# EAGLE board Pinscape Pico Expansion Board - DIY Friendly Main - Socketed Pico (EAGLE 7.7.0)
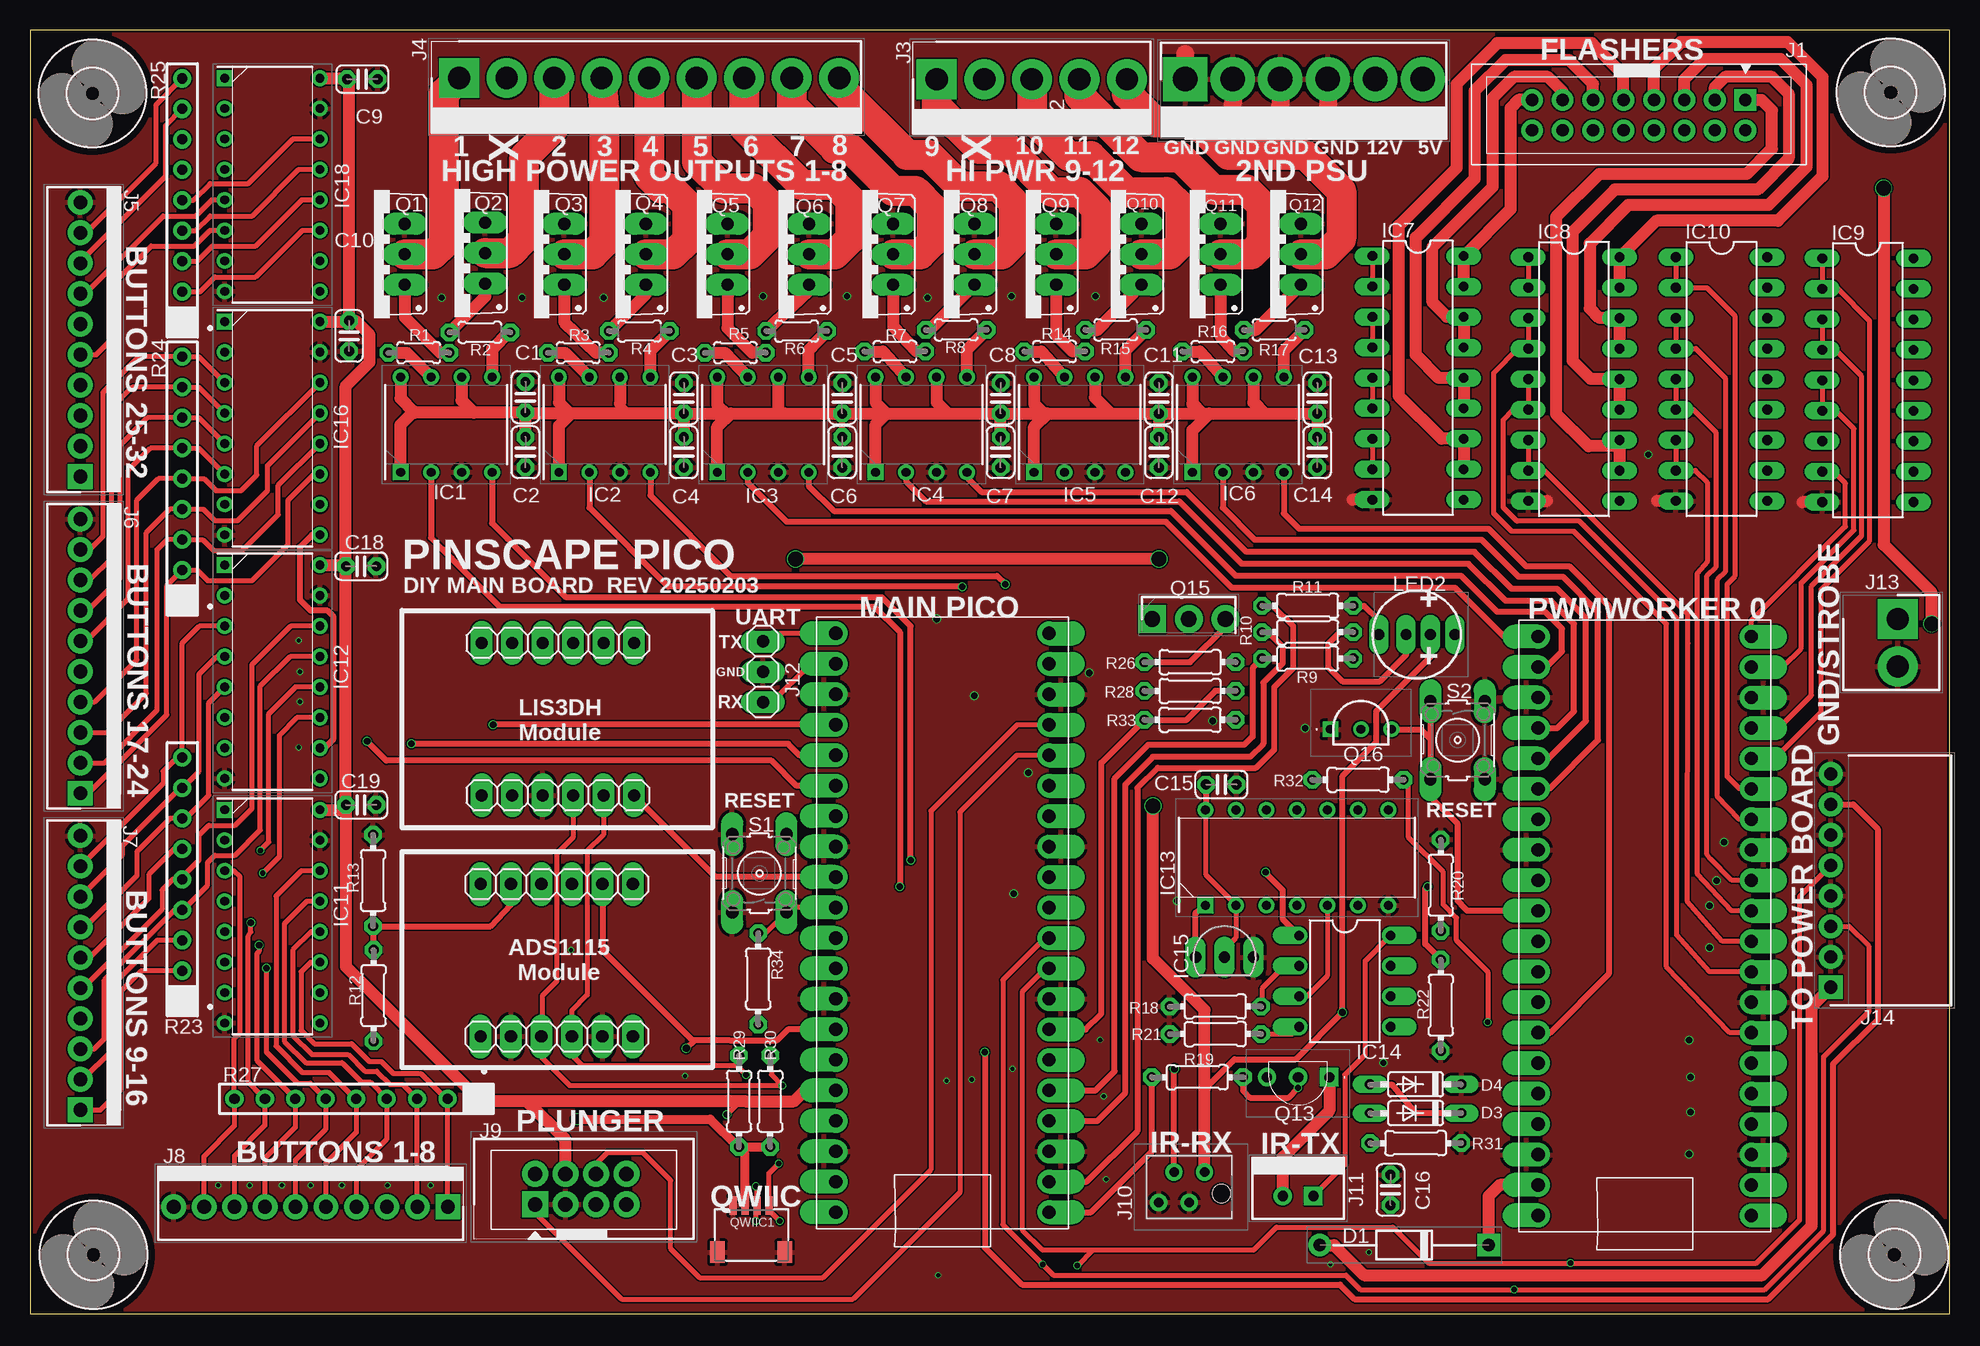
[diagram p11: board, top side]
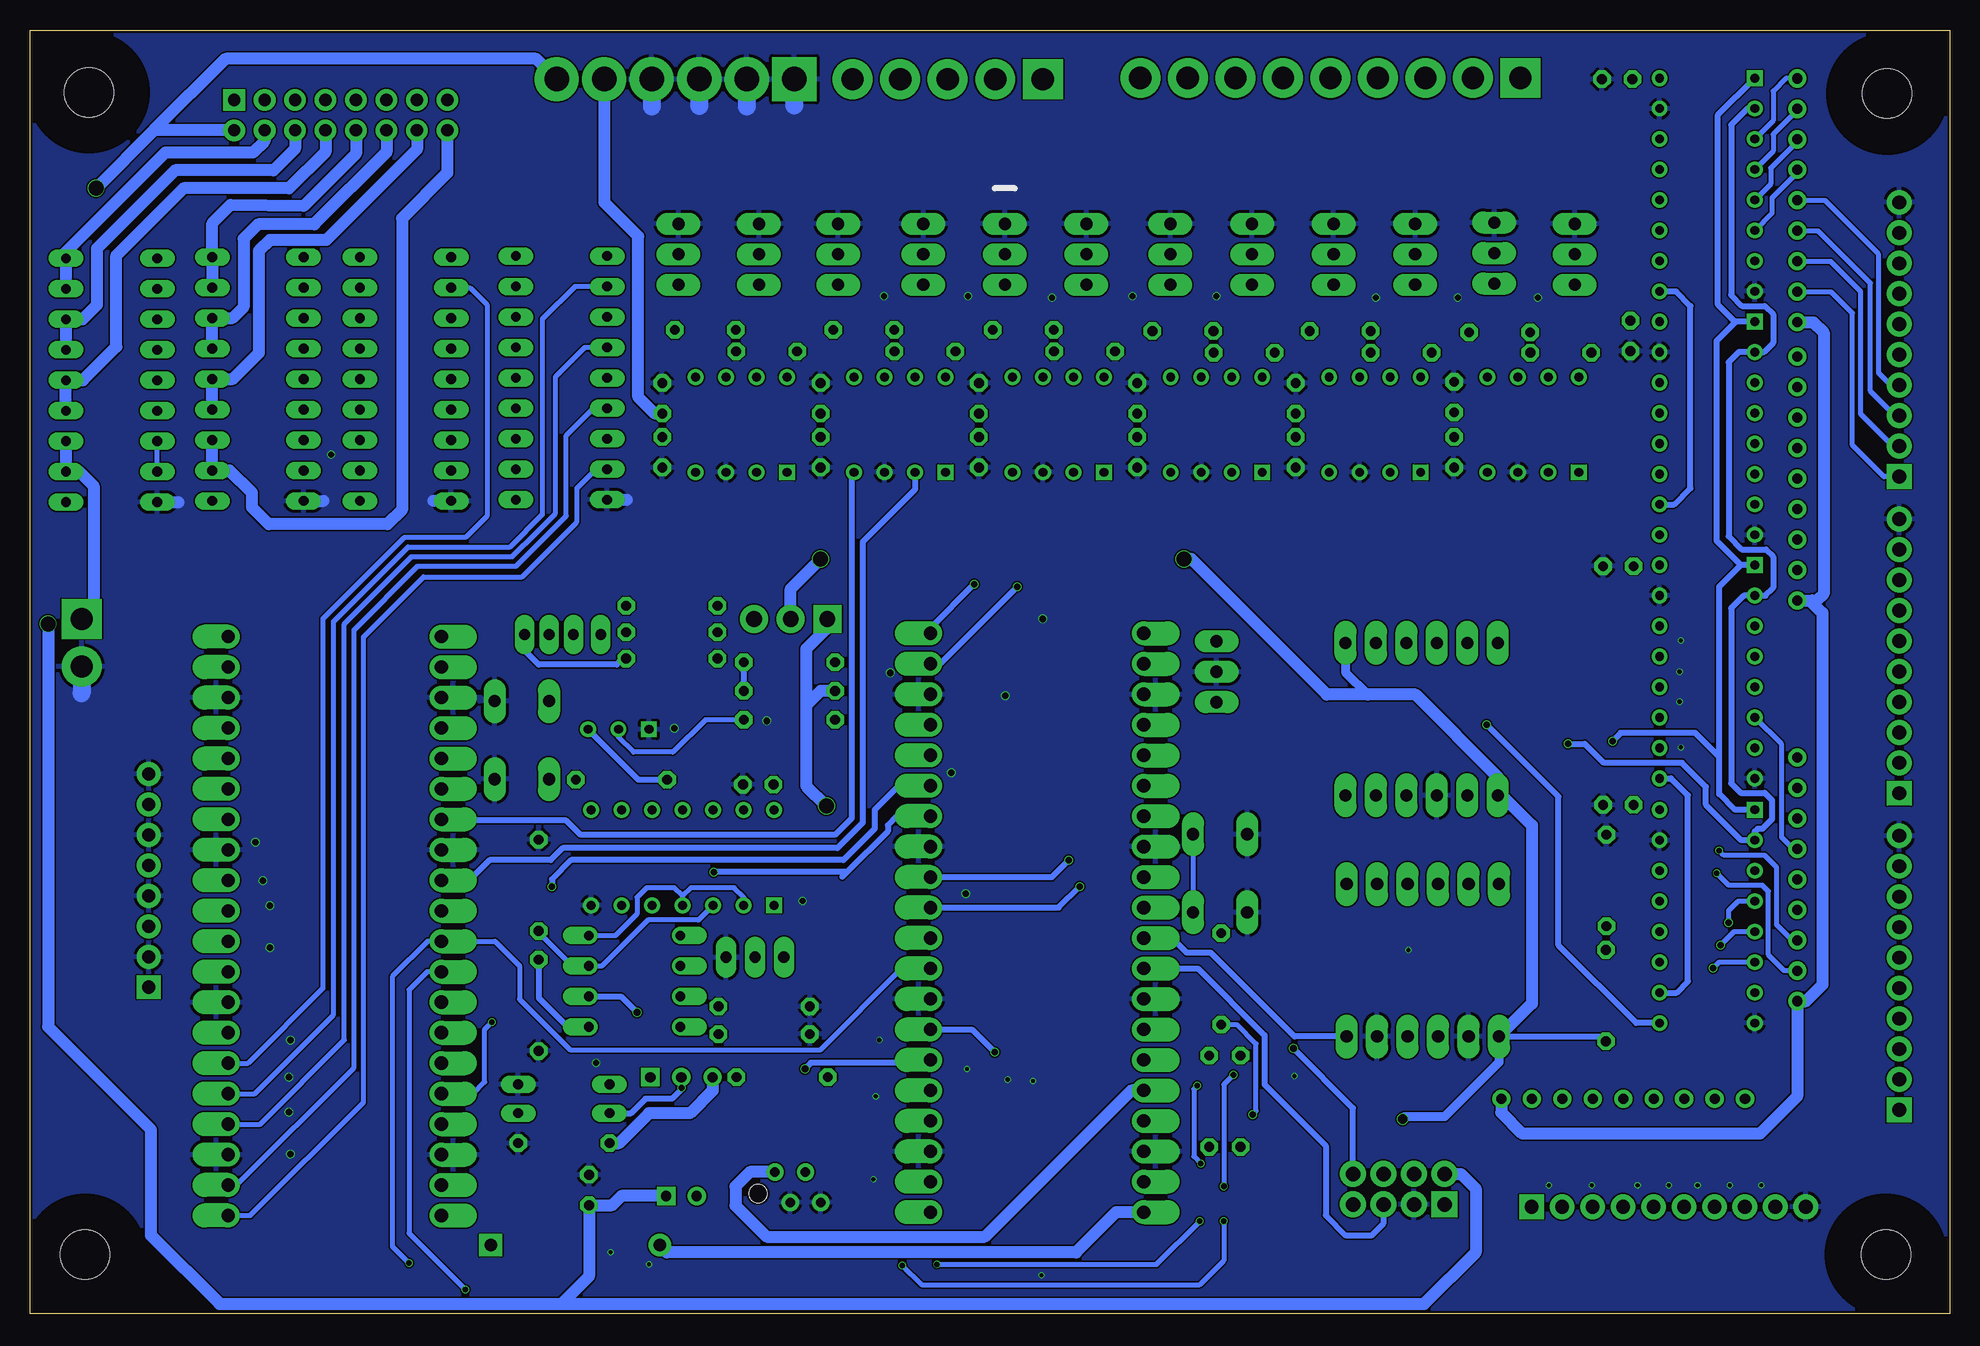
[diagram p12: board, bottom side, seen from below]

Size 160 x 107 mm. Coordinates in mm from the lower left corner, seen from the top.
Outline: 0,0 160,0 160,107 0,107 0,0
Copper layers (1*16): Top 0.035mm / dielectric 1.6mm / Bottom 0.035mm
Design rules "jlcpcb-2layers": minimum track width 5mil, minimum drill 0.3mm, track to track 5mil, track to pad 5mil, pad to pad 5mil, via to via 5mil, smd to smd 5mil, copper to edge 0.2mm, drill to drill 6mil, minimum pad ring 10mil, minimum via ring 3mil, stop-mask expansion 4mil, vias tented up to drill 0mil, thermal gap 10mil
Net classes: 1 highpower: width 0.305 mm, drill 0.483 mm

## Footprints (pad centres in the part's own frame; a part is rotated, then mirrored left to right if it is on the bottom)
C025-024X044 = drill 0.813 octagon: 1 -1.27,0; 2 1.27,0
DIOAD1408W86L464D236 = drill 1.05 pad 1.575 square: 1 0,0 | drill 1.05 pad 1.575: 2 14.1,0
DO35-7 = drill 0.813 long: A 3.81,0; C -3.81,0
DIP794W53P254L959H508Q8N = drill 0.73 pad 1.13 square: 1 -3.97,3.81 | drill 0.73 pad 1.13: 2 -3.97,1.27; 3 -3.97,-1.27; 4 -3.97,-3.81; 5 3.97,-3.81; 6 3.97,-1.27; 7 3.97,1.27; 8 3.97,3.81
DIL18 = drill 0.813 long: 1 -10.16,-3.81; 2 -7.62,-3.81; 3 -5.08,-3.81; 4 -2.54,-3.81; 5 0,-3.81; 6 2.54,-3.81; 7 5.08,-3.81; 8 7.62,-3.81; 9 10.16,-3.81; 10 10.16,3.81; 11 7.62,3.81; 12 5.08,3.81; 13 2.54,3.81; 14 0,3.81; 15 -2.54,3.81; 16 -5.08,3.81; 17 -7.62,3.81; 18 -10.16,3.81
DIP794W53P254L1930H508Q16N = drill 0.73 pad 1.13 square: 1 -3.97,8.89 | drill 0.73 pad 1.13: 2 -3.97,6.35; 3 -3.97,3.81; 4 -3.97,1.27; 5 -3.97,-1.27; 6 -3.97,-3.81; 7 -3.97,-6.35; 8 -3.97,-8.89; 9 3.97,-8.89; 10 3.97,-6.35; 11 3.97,-3.81; 12 3.97,-1.27; 13 3.97,1.27; 14 3.97,3.81; 15 3.97,6.35; 16 3.97,8.89
DIP794W53P254L1930H508Q14N = drill 0.73 pad 1.13 square: 1 -3.97,7.62 | drill 0.73 pad 1.13: 2 -3.97,5.08; 3 -3.97,2.54; 4 -3.97,0; 5 -3.97,-2.54; 6 -3.97,-5.08; 7 -3.97,-7.62; 8 3.97,-7.62; 9 3.97,-5.08; 10 3.97,-2.54; 11 3.97,0; 12 3.97,2.54; 13 3.97,5.08; 14 3.97,7.62
DIL08 = drill 0.813 offset: 1 -3.81,-3.81; 2 -1.27,-3.81; 3 1.27,-3.81; 4 3.81,-3.81; 5 3.81,3.81; 6 1.27,3.81; 7 -1.27,3.81; 8 -3.81,3.81
TO-92_(TO-226) = drill 0.94 pad 1.118 long: 1 1.143,0; 2 -1.27,0; 3 -3.683,0
3M-30316-6002HB = drill 1.01 pad 1.51 square: 1 -8.89,-1.27 | drill 1.01 pad 1.51: 2 -8.89,1.27; 3 -6.35,-1.27; 4 -6.35,1.27; 5 -3.81,-1.27; 6 -3.81,1.27; 7 -1.27,-1.27; 8 -1.27,1.27; 9 1.27,-1.27; 10 1.27,1.27; 11 3.81,-1.27; 12 3.81,1.27; 13 6.35,-1.27; 14 6.35,1.27; 15 8.89,-1.27; 16 8.89,1.27
SHDR6W183P0X396_1X6_2377X762X1 = drill 2.05 pad 3.075 square: 1 0,0 | drill 2.05 pad 3.075: 2 3.96,0; 3 7.92,0; 4 11.88,0; 5 15.84,0; 6 19.8,0
HDRV5W117P0X396_1X5_1981X762X1 = drill 1.85 pad 2.775 square: 1 7.92,0 | drill 1.85 pad 2.775: 2 3.958,0; 3 -0.004,0; 4 -3.966,0; 5 -7.928,0
SHDR9W117P0X396_1X9_3566X762X1 = drill 1.85 pad 2.775 square: 1 15.84,0 | drill 1.85 pad 2.775: 2 11.878,0; 3 7.916,0; 4 3.954,0; 5 -0.008,0; 6 -3.97,0; 7 -7.932,0; 8 -11.894,0; 9 -15.856,0
SHDR10W66P0X254_1X10_2540X572X = drill 1.15 pad 1.725 square: 1 11.43,0 | drill 1.15 pad 1.725: 2 8.89,0; 3 6.35,0; 4 3.81,0; 5 1.27,0; 6 -1.27,0; 7 -3.81,0; 8 -6.35,0; 9 -8.89,0; 10 -11.43,0
SHDR8W69P254_2X4_1780X878X955P = drill 1.2 pad 1.8 square: 1 0,0 | drill 1.2 pad 1.8: 2 0,2.54; 3 2.54,0; 4 2.54,2.54; 5 5.08,0; 6 5.08,2.54; 7 7.62,0; 8 7.62,2.54
2150794 = drill 0.8 pad 1.3: 1 0,0; 2 -1.27,-2.54; 3 -2.54,0; 4 -3.81,-2.54 | hole 1.5: 1.4,-1.8
HDRV2W66P0X254_1X2_762X572X100 = drill 0.85 pad 1.275 square: 1 1.27,0 | drill 0.85 pad 1.275: 2 -1.27,0
1X03 = drill 1.016 long: 1 -2.54,0; 2 0,0; 3 2.54,0
SHDR2W117P0X396_1X2_792X762X11 = drill 1.85 pad 2.775 square: 1 0,0 | drill 1.85 pad 2.775: 2 3.962,0
RHDRRA8W64P254_1X8_2083X851X24 = drill 1.1 pad 1.65 square: 1 0,0 | drill 1.1 pad 1.65: 2 -2.54,0; 3 -5.08,0; 4 -7.62,0; 5 -10.16,0; 6 -12.7,0; 7 -15.24,0; 8 -17.78,0
1X06 = drill 1.016 long: 1 -6.35,0; 2 -3.81,0; 3 -1.27,0; 4 1.27,0; 5 3.81,0; 6 6.35,0
5218559F = drill 0.91 pad 1.016 long: 1 0,1.27; 2 0,-0.762; 3 0,-2.794; 4 0,-5.08
RPI_PICO_TH_NO_DEBUG = drill 1.1 pad 1.6 offset: 3V3 8.89,13.97; 3V3_EN 8.89,16.51; ADC_VREF 8.89,11.43; AGND 8.89,6.35; GND@1 -8.89,19.05; GND@2 -8.89,6.35; GND@3 -8.89,-6.35; GND@4 -8.89,-19.05; GND@6 8.89,-19.05; GND@7 8.89,-6.35; GND@8 8.89,19.05; GP0 -8.89,24.13; GP1 -8.89,21.59; GP2 -8.89,16.51; GP3 -8.89,13.97; GP4 -8.89,11.43; GP5 -8.89,8.89; GP6 -8.89,3.81; GP7 -8.89,1.27; GP8 -8.89,-1.27; GP9 -8.89,-3.81; GP10 -8.89,-8.89; GP11 -8.89,-11.43; GP12 -8.89,-13.97; GP13 -8.89,-16.51; GP14 -8.89,-21.59; GP15 -8.89,-24.13; GP16 8.89,-24.13; GP17 8.89,-21.59; GP18 8.89,-16.51; GP19 8.89,-13.97; GP20 8.89,-11.43; GP21 8.89,-8.89; GP22 8.89,-3.81; GP26_A0 8.89,1.27; GP27_A1 8.89,3.81; GP28_A2 8.89,8.89; RUN 8.89,-1.27; VBUS 8.89,24.13; VSYS 8.89,21.59
TO220BV = drill 1.016 long: 1 -2.54,-2.54; 2 0,-2.54; 3 2.54,-2.54
BC33725 = drill 0.85 pad 1.381 square: 1 0,0 | drill 0.85 pad 1.381: 2 2.6,0; 3 5.2,0
TO229P300X760X1364-3P = drill 1.3 pad 1.95 square: 1 -0.762,0 | drill 1.3 pad 1.95: 2 2.29,0; 3 5.342,0
2N2222A = drill 0.72 pad 1.234 square: 1 0,0 | drill 0.72 pad 1.234: 2 2.54,0; 3 5.08,0
JST_SH4 = smd 0.6 x 1.55: 1 -1.5,2.514; 2 -0.5,2.514; 3 0.5,2.514; 4 1.5,2.514 | smd 1.2 x 1.8: MT1 -2.8,-1.386; MT2 2.8,-1.386
0204/5 = drill 0.813 pad 1.333 octagon: 1 -2.54,0; 2 2.54,0
0204/7 = drill 0.813 octagon: 1 -3.81,0; 2 3.81,0
4609X = drill 0.84 pad 1.34: 1 -10.16,0; 2 -7.62,0; 3 -5.08,0; 4 -2.54,0; 5 0,0; 6 2.54,0; 7 5.08,0; 8 7.62,0; 9 10.16,0
B3F-10XX = drill 1.016 long: 1 -3.251,2.261; 2 3.251,2.261; 3 -3.251,-2.261; 4 3.251,-2.261
4,1 = hole 4.1: 0,0

## Placement (x,y rotation side)
C1  100nF  [C025-024X044]  41.3,76.4 270 top
C2  4.7uF  [C025-024X044]  41.3,71.8 90 top
C3  100nF  [C025-024X044]  54.5,76.3 270 top
C4  4.7uF  [C025-024X044]  54.5,71.8 90 top
C5  100nF  [C025-024X044]  67.7,76.3 270 top
C6  4.7uF  [C025-024X044]  67.7,71.8 90 top
C7  100nF  [C025-024X044]  80.9,71.8 90 top
C8  4.7uF  [C025-024X044]  80.9,76.3 270 top
C9  100nF  [C025-024X044]  27.7,102.9 180 top
C10  100nF  [C025-024X044]  26.6,81.5 90 top
C11  100nF  [C025-024X044]  94.1,76.3 270 top
C12  4.7uF  [C025-024X044]  94.1,71.8 90 top
C13  100nF  [C025-024X044]  107.3,76.3 270 top
C14  4.7uF  [C025-024X044]  107.3,71.8 90 top
C15  100nF  [C025-024X044]  99.3,44.1 0 top
C16  4.7uF  [C025-024X044]  113.4,10.3 90 top
C18  100nF  [C025-024X044]  27.6,62.3 180 top
C19  100nF  [C025-024X044]  27.6,42.4 180 top
D1  SB140-T  [DIOAD1408W86L464D236]  121.6,5.7 180 top
D3  1N4148  [DO35-7]  115.5,16.7 180 top
D4  1N4148  [DO35-7]  115.5,19.1 180 top
IC1  UCC27524P  [DIP794W53P254L959H508Q8N]  34.7,74.1 90 top
IC2  UCC27524P  [DIP794W53P254L959H508Q8N]  47.9,74.1 90 top
IC3  UCC27524P  [DIP794W53P254L959H508Q8N]  61.1,74.1 90 top
IC4  UCC27524P  [DIP794W53P254L959H508Q8N]  74.3,74.1 90 top
IC5  UCC27524P  [DIP794W53P254L959H508Q8N]  87.5,74.1 90 top
IC6  UCC27524P  [DIP794W53P254L959H508Q8N]  100.7,74.1 90 top
IC7  ULN2803A  [DIL18]  115.7,78 270 top
IC8  ULN2803A  [DIL18]  128.7,77.9 270 top
IC9  ULN2803A  [DIL18]  153.2,77.8 270 top
IC10  ULN2803A  [DIL18]  141,77.9 270 top
IC11  SN74HC165N  [DIP794W53P254L1930H508Q16N]  20.2,33.1 0 top
IC12  SN74HC165N  [DIP794W53P254L1930H508Q16N]  20.2,53.5 0 top
IC13  SN74HC74NE4  [DIP794W53P254L1930H508Q14N]  105.6,38 90 top
IC14  PC827  [DIL08]  109.6,27.7 270 top
IC15  S-80833CLY  [TO-92_(TO-226)]  98.3,29.7 180 top
IC16  SN74HC165N  [DIP794W53P254L1930H508Q16N]  20.2,73.8 0 top
IC18  SN74HC165N  [DIP794W53P254L1930H508Q16N]  20.2,94.1 0 top
J1  30316-6002HB  [3M-30316-6002HB]  134.1,99.9 180 top
J2  640445-6  [SHDR6W183P0X396_1X6_2377X762X1]  96.3,102.9 0 top
J3  640445-5  [HDRV5W117P0X396_1X5_1981X762X1]  83.5,102.9 180 top
J4  640445-9  [SHDR9W117P0X396_1X9_3566X762X1]  51.6,103 180 top
J5  1-640456-0  [SHDR10W66P0X254_1X10_2540X572X]  4.2,81.2 270 top
J6  1-640456-0  [SHDR10W66P0X254_1X10_2540X572X]  4.2,54.8 270 top
J7  1-640456-0  [SHDR10W66P0X254_1X10_2540X572X]  4.2,28.4 270 top
J8  1-640456-0  [SHDR10W66P0X254_1X10_2540X572X]  23.4,8.9 0 top
J9  30308-6002HB  [SHDR8W69P254_2X4_1780X878X955P]  42.1,9.1 0 top
J10  215079-4  [2150794]  97.9,11.8 0 top
J11  640454-2  [HDRV2W66P0X254_1X2_762X572X100]  105.7,9.8 0 top
J12  [1X03]  61.1,53.5 270 top
J13  640445-2  [SHDR2W117P0X396_1X2_792X762X11]  155.7,57.9 270 top
J14  SSQ-108-02-T-S-RA  [RHDRRA8W64P254_1X8_2083X851X24]  150.1,27.2 270 top
JP1  [1X06]  44,55.9 0 top
JP2  [1X06]  44,43.2 0 top
JP3  [1X06]  43.9,35.8 0 top
JP4  [1X06]  43.9,23.1 0 top
LED2  521-8559F  [5218559F]  117.5,56.6 270 top
PICO1  [RPI_PICO_TH_NO_DEBUG]  76.05,32.57 180 top
PICO2  [RPI_PICO_TH_NO_DEBUG]  134.6,32.3 180 top
Q1  FDPF085N10A  [TO220BV]  28.7,88.3 90 top
Q2  FDPF085N10A  [TO220BV]  35.4,88.4 90 top
Q3  FDPF085N10A  [TO220BV]  42,88.3 90 top
Q4  FDPF085N10A  [TO220BV]  48.8,88.3 90 top
Q5  FDPF085N10A  [TO220BV]  55.6,88.3 90 top
Q6  FDPF085N10A  [TO220BV]  62.4,88.3 90 top
Q7  FDPF085N10A  [TO220BV]  69.4,88.3 90 top
Q8  FDPF085N10A  [TO220BV]  76.2,88.3 90 top
Q9  FDPF085N10A  [TO220BV]  83,88.3 90 top
Q10  FDPF085N10A  [TO220BV]  90.1,88.3 90 top
Q11  FDPF085N10A  [TO220BV]  96.7,88.3 90 top
Q12  FDPF085N10A  [TO220BV]  103.4,88.3 90 top
Q13  BC337-25  [BC33725]  108.3,19.7 180 top
Q15  2N5195G  [TO229P300X760X1364-3P]  94.3,57.9 0 top
Q16  2N2222A  [2N2222A]  108.4,48.7 0 top
QWIIC1  QWIIC  [JST_SH4]  60.1,6.5 0 top
R1  4R7  [0204/5]  32.4,80.1 0 top
R2  4R7  [0204/5]  37.5,81.8 180 top
R3  4R7  [0204/5]  45.7,80.1 0 top
R4  4R7  [0204/5]  50.8,81.9 180 top
R5  4R7  [0204/5]  58.8,80.1 0 top
R6  4R7  [0204/5]  63.9,81.9 180 top
R7  4R7  [0204/5]  72.1,80.2 0 top
R8  4R7  [0204/5]  77.2,82 180 top
R9  100R  [0204/7]  106.5,54.6 0 top
R10  10R  [0204/7]  106.5,56.8 0 top
R11  10R  [0204/7]  106.5,59 0 top
R12  10K  [0204/7]  28.64,26.5 270 top
R13  10K  [0204/7]  28.6,36.1 270 top
R14  4R7  [0204/5]  85.4,80.2 0 top
R15  4R7  [0204/5]  90.5,82 180 top
R16  4R7  [0204/5]  98.6,80.2 0 top
R17  4R7  [0204/5]  103.7,82 180 top
R18  240R  [0204/7]  98.8,25.6 0 top
R19  540R  [0204/7]  97.3,19.7 0 top
R20  10K  [0204/7]  117.6,35.7 90 top
R21  360R  [0204/7]  98.8,23.3 0 top
R22  10K  [0204/7]  117.6,25.7 90 top
R23  4609X-101-103F  [4609X]  12.7,36.2 90 top
R24  4609X-101-103F  [4609X]  12.7,69.6 90 top
R25  4609X-101-103F  [4609X]  12.7,92.8 90 top
R26  1K  [0204/7]  96.7,54.3 180 top
R27  4609X-101-103F  [4609X]  27.2,17.9 180 top
R28  22K  [0204/7]  96.7,51.9 180 top
R29  15K  [0204/7]  59.1,17.7 270 top
R30  15K  [0204/7]  61.7,17.7 270 top
R31  2R5  [0204/7]  115.5,14.2 180 top
R32  4.7K  [0204/7]  110.7,44.5 0 top
R33  2.2k  [0204/7]  96.7,49.5 0 top
R34  4.7K  [0204/7]  60.7,27.9 270 top
S1  [B3F-10XX]  60.8,36.7 90 top
S2  [B3F-10XX]  119,47.8 270 top
U$1  [4,1]  5.2,101.7 0 top
U$2  [4,1]  155.1,101.8 0 top
U$3  [4,1]  155.4,4.9 0 top
U$4  [4,1]  5.3,4.9 0 top

## Tracks (layer width: path | path; a pad name or v marks a point on that pad's centre or on a via)
3V3_PERIPHERAL  (via drill 0.8, 1.25)
  Top 0.5: R29.2 59.05,13.85
  Top 0.75: v45.6,16.2 56.7,16.2 59.05,13.85 59.6,13.3 QWIIC1.2 | R29.2 R30.2
  Top 1: v94.1,62.9 v63.8,62.9
  Bottom 0.5: JP4.1 29.05,23.1 R12.2
  Bottom 0.75: JP4.1 37.55,20.95 42.1,16.4 45.4,16.4 v45.6,16.2 | JP1.6 50.35,53.45 48.5,51.6
  Bottom 1: JP4.1 34.8,25.85 34.8,40.7 37.3,43.2 JP2.1 37.65,44.75 44.5,51.6 48.5,51.6 51.9,51.6 63.2,62.9 v63.8,62.9 | Q15.2 96.59,60.41 v94.1,62.9
3V3_PICO  (via drill 0.55, 0.6, 1.25)
  Top 0.4: 59.6,17.7 59.2,17.7 v58.1,16.6
  Top 0.5: 97.9,18.7 100.4,21.2 105.5,21.2 v109.4,25.1 109.4,44.8 112.2,47.6 112.2,50.2 116.74,54.74 LED2.2
  Top 1: 41.4,17.7 59.6,17.7 63.7,17.7 64.6,18.6 PICO1.3V3 | 41.4,17.7 37.56,17.7 R27.1 26.33,28.93 C19.2 | IC18.16 26.48,102.99 C9.2 26.6,102.73 C10.2 | IC16.16 26.52,82.69 C10.2 | IC12.16 26.18,62.39 C18.2 | IC11.16 26.18,41.99 C19.2 | C10.2 27.13,82.77 28.3,81.6 28.3,79.3 26.33,77.33 C18.2 | C19.2 C18.2 | J10.1 97.9,18.7 97.9,25.3 93.6,29.6 v93.6,42.3 | J9.4 44.64,14.46 41.4,17.7
  Bottom 0.4: R34.2 59.4,24.09 57.8,22.49 57.8,16.9 v58.1,16.6
  Bottom 0.5: IC14.6 110.73,26.43 v109.4,25.1
  Bottom 1: R27.1 37.36,16.76 35.6,15 15.8,15 12.7,18.1 R23.1 11.96,26.04 10.6,27.4 10.6,58.4 11.47,59.27 11.47,59.44 | R25.1 11.34,82.64 10.5,81.8 10.5,60 11.06,59.44 11.47,59.44 | R24.1 11.47,59.44 | Q15.1 93.6,57.84 93.6,57.1 95.3,55.4 95.3,50.7 | 95.3,50.7 95.3,44 v93.6,42.3 | R28.2 94.1,51.9 95.3,50.7 | J10.1 100,11.8 101.2,10.6 101.2,9 98.6,6.4 80.4,6.4 68.2,18.6 PICO1.3V3
5V  (via drill 1.25)
  Top 0.4: IC13.14 97.98,36.62 100.52,34.08 IC13.2 100.52,31.32 99.57,30.37 IC15.2 | IC14.8 111.3,29.4 111.3,21.6 109.6,19.9 109.6,12.43 J11.1
  Top 0.5: C15.1 98.03,42.02 IC13.14
  Top 1: v154.5,93.8 154.5,64.1 158.5,60.1 v158.5,57.5
  Bottom 0.4: 105.6,34.8 106.3,35.5 108.6,35.5 109.4,34.7 109.4,33.3 111.19,31.51 IC14.8 | IC13.4 105.6,34.8 | IC13.2 100.52,34.72 101.3,35.5 104.9,35.5 105.6,34.8
  Bottom 1: J1.2 149.67,98.63 | v158.5,57.5 158.5,23.9 149.9,15.3 149.9,6.5 144.2,0.8 115.7,0.8 | J9.2 40.74,11.64 39.5,10.4 39.5,5.1 43.8,0.8 115.7,0.8 | 149.67,98.63 v154.5,93.8 | J11.1 110.7,9.8 111.47,9.03 C16.1 113.4,3.1 115.7,0.8 | 149.67,98.63 143.7,104.6 117.8,104.6 J2.6
12V
  Top 0.406: 41.27,75.1 C1.2 | 41.27,73.1 C2.2
  Top 0.5: 32.09,75.1 32,75.19 | 45.1,75.03 45,75.03 | 41.4,75.03 C1.2 | 49.17,75.86 50,75.03 | 58,75.03 58.4,75.03 | C6.2 C5.2 | 62.37,75.56 62.9,75.03
  Top 1: IC1.8 30.89,76.3 32,75.19 30.89,74.09 IC1.1 | 37,75.1 41.27,75.1 41.27,73.1 | 37,75.1 32.09,75.1 | C3.2 50,75.03 45.1,75.03 44.09,74.02 IC2.1 | 41.4,75.03 45,75.03 44.09,75.94 IC2.8 | IC1.6 35.97,76.13 37,75.1 | IC2.6 49.17,75.86 | C4.2 C3.2 | C3.2 58,75.03 57.29,75.74 IC3.8 | 71.4,75.03 C5.2 62.9,75.03 58.4,75.03 57.29,73.92 IC3.1 | 71.4,75.03 76.5,75.03 | 76.5,75.03 C8.2 | C7.2 C8.2 | IC4.6 75.57,75.96 76.5,75.03 | IC4.8 70.49,75.94 71.4,75.03 | IC3.6 62.37,75.56 | IC4.1 70.49,74.12 71.4,75.03 | C8.2 84.5,75.03 | 84.5,75.03 84.8,75.03 | 84.8,75.03 90.1,75.03 | 90.1,75.03 C11.2 | C11.2 C12.2 | IC5.6 88.77,76.36 90.1,75.03 | IC5.8 83.69,75.84 84.5,75.03 | IC5.1 83.69,73.92 84.8,75.03 | C11.2 97.7,75.03 | 97.7,75.03 98.3,75.03 | 98.3,75.03 102.9,75.03 | 102.9,75.03 C13.2 C14.2 | IC6.8 96.89,75.84 97.7,75.03 | IC6.6 101.97,75.96 102.9,75.03 | IC6.1 96.89,73.62 98.3,75.03
  Bottom 1: C13.2 107.93,75.03 109.3,76.4 109.3,89.8 112.14,92.64 J2.5
$N377  (via drill 0.5)
  Top 0.5: R19.2 101.11,18.59 101.7,18 104.9,18 v105.7,18.8 Q13.2
  Bottom 0.5: v105.7,18.8 105.7,18.7 106.5,17.9 108.7,17.9 109.9,16.7 D3.A
/PERIPHERAL_POWER_ENABLE  (via drill 0.55)
  Top 0.5: R28.1 98.8,51.9 96.4,49.5 R33.1 89.3,45.91 89.3,25 87.98,23.68 PICO1.GP5 | v79.6,21.8 79.6,5.5 82.7,2.4 109.2,2.4 110.4,1.2 144.9,1.2 150.3,6.6 150.3,20.8 154,24.5 154,40.4 151.96,42.44 J14.7
  Bottom 0.5: R26.1 R28.1 | PICO1.GP5 81.48,23.68 v79.6,21.8
ACCEL_INTR
  Top 0.5: JP2.6 57.15,36.4 67.14,36.4 PICO1.GP22
ADC_INTR
  Bottom 0.5: JP4.6 54.6,23.1 61.6,30.1 63.6,30.1 64.8,31.3 PICO1.GP26_A0
BUTTON1
  Top 0.4: J8.1 R27.2 34.7,17.9 32.6,20 30.3,20 29.3,21 28.3,21 26.8,22.5 23.7,22.5 22.6,23.6 22.6,28.5 23.39,29.29 IC11.11
BUTTON2
  Top 0.4: J8.2 R27.3 31.08,19.1 30,19.1 28.9,20.2 27.9,20.2 26.5,21.6 23.5,21.6 21.9,23.2 21.9,30.3 23.43,31.83 IC11.12
BUTTON3
  Top 0.4: J8.4 27.21,12.01 29.74,14.54 R27.4 28.34,19.3 27.6,19.3 26,20.9 23,20.9 21.2,22.7 21.2,32.5 23.07,34.37 IC11.13
BUTTON4
  Top 0.4: J8.5 24.67,12.57 27.2,15.1 R27.5 27.1,17.9 24.9,20.1 24.1,20.1 23.8,20.1 22.7,20.1 20.5,22.3 20.5,34.8 22.61,36.91 IC11.14
BUTTON5  (via drill 0.55)
  Top 0.4: J8.6 22.13,12.83 24.66,15.36 R27.6 23.36,19.2 22.3,19.2 19.7,21.8 v19.7,28.8
  Bottom 0.4: IC11.6 19.21,29.29 v19.7,28.8
BUTTON6  (via drill 0.55)
  Top 0.4: J8.7 19.59,12.99 22.12,15.52 R27.7 18.9,21.12 18.9,30 19.1,30.2 v19.1,30.7
  Bottom 0.4: IC11.5 17.97,31.83 v19.1,30.7
BUTTON7  (via drill 0.55)
  Top 0.4: J8.8 17.05,13.15 19.58,15.68 R27.8 18.7,18.78 18.7,18.8 18.2,19.3 18.2,31.5 18.4,31.8 v18.4,32.6
  Bottom 0.4: v18.4,32.6 18.4,33.6 17.63,34.37 IC11.4
BUTTON8
  Top 0.4: J8.9 14.51,13.11 17.04,15.64 R27.9 17.04,22.94 17.5,23.4 17.5,36.4 16.99,36.91 IC11.3
BUTTON9  (via drill 0.45)
  Top 0.4: J7.1 5.87,16.97 7.6,18.7 7.6,26.9 9.28,28.58 R23.2 | v19.4,36.7 20.8,38.1 20.8,48.2 22.29,49.69 IC12.11
  Bottom 0.4: R23.2 13.78,28.58 15.1,29.9 15.1,35.2 15.6,35.7 18.4,35.7 v19.4,36.7
BUTTON10  (via drill 0.45)
  Top 0.4: J7.2 4.41,19.51 6.9,22 6.9,27.4 10.62,31.12 R23.3 | v19.2,38.6 19.9,39.3 19.9,50 22.13,52.23 IC12.12
  Bottom 0.4: R23.3 13.12,31.12 14.4,32.4 14.4,37.2 15.4,38.2 18.8,38.2 v19.2,38.6
BUTTON11
  Top 0.4: J7.3 5.35,22.05 6.2,22.9 6.2,27.8 12.06,33.66 R23.4 12.76,33.66 14.8,35.7 14.8,37.6 15.4,38.2 17.1,38.2 19.2,40.3 19.2,52.3 21.67,54.77 IC12.13
BUTTON12
  Top 0.4: J7.5 4.43,27.13 11,33.7 11,35.3 11.9,36.2 R23.5 12.7,36.4 14.1,37.8 14.1,39.9 14.9,40.7 17.1,40.7 18.5,42.1 18.5,54.1 21.71,57.31 IC12.14
BUTTON13
  Top 0.4: J7.6 4.97,29.67 9.9,34.6 9.9,36.6 12.04,38.74 R23.6
  Bottom 0.4: R23.6 13.04,38.74 14,39.7 14,47.46 IC12.6
BUTTON14
  Top 0.4: J7.7 4.61,32.21 8.9,36.5 8.9,38.5 11.68,41.28 R23.7 12.98,41.28 14.9,43.2 14.9,50.9 IC12.5
BUTTON15
  Top 0.4: 4.2,34.9 J7.8 7.7,38.25 7.7,39 12.52,43.82 R23.8 12.72,43.82 14.1,45.2 14.1,53.3 15.57,54.77 IC12.4
BUTTON16
  Top 0.4: J7.9 11.1,44.19 11.1,45.2 12.26,46.36 R23.9 12.7,55.9 14.11,57.31 IC12.3
BUTTON17
  Top 0.4: IC16.11 23.69,69.99 21.5,67.8 21.5,64.1 18.5,61.1 14.8,61.1 13.92,61.98 R24.2 11.4,60.68 11.4,49.9 4.87,43.37 J6.1
BUTTON18
  Top 0.4: J6.2 6.21,45.91 10.6,50.3 10.6,63.7 11.42,64.52 R24.3 14.38,64.52 15.3,63.6 17.7,63.6 20.7,66.6 20.7,69.06 IC16.12
BUTTON19
  Top 0.4: J6.3 6.45,48.45 9.7,51.7 9.7,65.1 11.66,67.06 R24.4 14.44,67.06 15.4,66.1 17.3,66.1 19.8,68.6 19.8,70.7 IC16.13
BUTTON20
  Top 0.4: J6.4 5.39,50.99 8.9,54.5 8.9,67.8 10.7,69.6 R24.5 14.5,69.6 15.5,68.6 17.6,68.6 18.9,69.9 18.9,72.34 IC16.14
BUTTON21
  Top 0.4: J6.6 4.67,56.07 8.2,59.6 8.2,70.3 10.04,72.14 R24.6 14.08,72.14 IC16.6
BUTTON22
  Top 0.4: J6.7 4.81,58.61 7.5,61.3 7.5,72.4 9.78,74.68 R24.7 14.08,74.68 IC16.5
BUTTON23
  Top 0.4: J6.8 4.95,61.15 6.8,63 6.8,75.5 8.52,77.22 R24.8 14.08,77.22 IC16.4
BUTTON24
  Top 0.4: J6.9 4.99,63.69 6.1,64.8 6.1,76.8 9.06,79.76 R24.9 14.08,79.76 IC16.3
BUTTON25
  Top 0.4: R25.2 14.18,85.18 15.4,86.4 18.8,86.4 22.69,90.29 IC18.11
  Bottom 0.4: J5.1 5.47,69.77 8.1,72.4 8.1,83.4 9.4,84.7 9.7,85 9.88,85.18 R25.2
BUTTON26
  Top 0.4: R25.3 13.92,87.72 15.2,89 18.8,89 22.63,92.83 IC18.12
  Bottom 0.4: J5.2 4.71,72.31 7.4,75 7.4,85.2 9.92,87.72 R25.3
BUTTON27
  Top 0.4: R25.4 13.76,90.26 15,91.5 18.5,91.5 22.37,95.37 IC18.13
  Bottom 0.4: J5.3 4.55,74.85 6.6,76.9 6.6,85.9 10.96,90.26 R25.4
BUTTON28
  Top 0.4: R25.5 13.6,92.8 15,94.2 18.2,94.2 21.91,97.91 IC18.14
  Bottom 0.4: J5.4 4.89,77.39 5.9,78.4 5.9,88.3 10.4,92.8 R25.5
BUTTON29
  Top 0.4: J5.5 5.53,79.93 6.7,81.1 6.7,85.6 10.1,89 13.7,89 14.99,90.29 IC18.6
  Bottom 0.4: R25.6 12.7,95.1 14.8,93 14.8,91.72 IC18.6
BUTTON30
  Top 0.4: J5.7 4.61,85.01 11.1,91.5 13.8,91.5 15.13,92.83 IC18.5
  Bottom 0.4: R25.7 12.7,97.7 14.9,95.5 14.9,94.16 IC18.5
BUTTON31
  Top 0.4: J5.8 4.2,87.7 11.3,94.8 11.3,99.02 R25.8
  Bottom 0.4: R25.8 12.7,100.3 14.7,98.3 14.7,96.9 IC18.4
BUTTON32
  Top 0.4: J5.9 4.69,90.09 10.5,95.9 10.5,100.76 R25.9
  Bottom 0.4: R25.9 13.64,102.96 14.7,101.9 14.7,99.44 IC18.3
BUTTON_CLK  (via drill 0.55)
  Top 0.5: v31.8,47.5 63.2,47.5 64.16,46.54 PICO1.GP19
  Bottom 0.5: IC18.2 16.85,100.45 18.2,99.1 18.2,84.9 17.3,84 15.4,84 14.7,83.3 14.7,80.9 15.45,80.15 IC16.2 17.55,80.15 18.4,79.3 18.4,64.8 17.3,63.7 15.3,63.7 14.7,63.1 14.7,60.5 15.35,59.85 IC12.2 17.15,59.85 18.2,58.8 18.2,44.2 17.4,43.4 15.4,43.4 14.8,42.8 14.8,41.2 15.6,40.4 16,40.4 16.23,40.17 IC11.2 17.35,39.45 20.3,42.4 20.3,43.9 22.3,45.9 28.8,45.9 30.4,47.5 v31.8,47.5
BUTTON_DATA  (via drill 0.55)
  Top 0.5: v38.6,49.1 67.14,49.1 PICO1.GP18
  Bottom 0.5: IC11.9 26.11,24.21 32.6,30.7 32.6,43.1 v38.6,49.1
BUTTON_SHLD  (via drill 0.55)
  Top 0.5: v28.1,47.7 29.7,46.1 61.8,46.1 63.9,44 PICO1.GP20
  Bottom 0.5: IC11.1 17.89,41.99 19.2,43.3 19.2,46.4 | 19.2,46.4 19.2,60.6 17.5,62.3 | 17.5,62.3 17.41,62.39 IC12.1 | 17.5,62.3 17.5,62.5 19.4,64.4 19.4,81.1 17.9,82.6 | 17.9,82.6 17.81,82.69 IC16.1 | 17.9,82.6 17.9,82.7 19.3,84.1 19.3,99.92 IC18.1 | 19.2,46.4 21.2,48.4 27.4,48.4 v28.1,47.7
FLASHCTL1
  Top 0.4: IC7.1 IC7.2
  Bottom 0.4: IC7.2 114.58,85.62 117.3,82.9 117.3,66.6 120,63.9 128.5,63.9 134.7,57.7 134.7,24.9 141.27,18.33 PICO2.GP3
FLASHCTL2
  Top 0.4: IC7.3 IC7.4
  Bottom 0.4: PICO2.GP2 140.81,15.79 133.8,22.8 133.8,57.5 128.2,63.1 119.8,63.1 117.7,65.2 117,65.9 116.2,66.7 116.2,78.1 113.76,80.54 IC7.4
FLASHCTL3
  Top 0.4: IC7.5 IC7.6
  Bottom 0.4: PICO2.GP1 142.79,10.71 133,20.5 133,57 127.7,62.3 119.5,62.3 117.3,64.5 117.05,64.75 115.3,66.5 115.3,73.2 113.04,75.46 IC7.6
FLASHCTL4
  Top 0.4: IC7.7 IC7.8
  Bottom 0.4: PICO2.GP0 141.63,8.17 132.2,17.6 132.2,56.4 127.2,61.4 119,61.4 114.4,66 114.4,68.8 112.8,70.4 111.91,70.4 IC7.8
FLASHCTL5
  Top 0.4: IC8.1 IC8.2
  Bottom 0.4: IC8.2 123.32,85.52 121.9,84.1 121.9,66.5 123.7,64.7 128.8,64.7 135.6,57.9 135.6,27.1 141.83,20.87 PICO2.GP4
FLASHCTL6
  Top 0.4: IC8.3 IC8.4 124.04,80.44 122,78.4 122,66.7 123.5,65.2 128.7,65.2 136.4,57.5 136.4,28.9 141.69,23.41 PICO2.GP5
FLASHCTL7
  Top 0.4: IC8.5 IC8.6 123.66,75.36 122.8,74.5 122.8,67.2 123.95,66.05 129.15,66.05 137.25,57.95 137.25,31.56 140.02,28.49 PICO2.GP6
FLASHCTL8
  Top 0.4: IC8.7 IC8.8 126.22,70.28 138.19,58.31 138.19,55.87 138.15,34.35 141.07,31.03 PICO2.GP7
FLASHCTL9
  Top 0.4: IC10.7 IC10.8 138.82,70.28 139.8,69.3 139.8,62.67 138.98,61.75 138.98,36.63 141.84,33.57 PICO2.GP8
FLASHCTL10
  Top 0.4: IC10.5 IC10.6 138.64,75.36 140.5,73.5 140.5,62.2 139.79,61.49 139.79,38.27 140.04,37.92 140.06,37.92 141.87,36.11 PICO2.GP9
FLASHCTL11
  Top 0.4: IC10.3 IC10.4 138.86,80.44 141.3,78 141.3,61.83 140.65,61.18 140.65,43.1 142.46,41.19 PICO2.GP10
FLASHCTL12
  Top 0.4: IC10.1 IC10.2 139.78,85.52 142.1,83.2 142.1,61.45 141.46,60.81 141.46,44.77 142.5,43.73 PICO2.GP11
FLASHCTL13
  Top 0.4: IC9.5 IC9.6 150.53,75.26 152.03,73.76 152.03,65.31 147.63,60.91 147.63,55.44 146.08,53.89 PICO2.GP14
FLASHCTL14
  Top 0.4: IC9.3 IC9.4 150.47,80.34 152.68,78.13 152.68,64.84 148.48,60.64 148.48,51.53 145.76,48.81 PICO2.GP13
FLASHCTL15
  Top 0.4: IC9.1 IC9.2 150.67,85.42 153.34,82.75 153.34,64.4 149.31,60.37 149.31,50.13 145.45,46.27 PICO2.GP12
FLASHCTL16
  Top 0.4: IC9.8 149.45,70.12 150.42,70.12 151.33,69.21 151.33,65.59 151.29,65.59 143.49,57.79 PICO2.GP15
  Bottom 0.4: IC9.8 IC9.7
FLASHER1
  Top 1: IC7.18 | IC7.17 IC7.18 | J1.15 124.07,101.17 123.4,100.5 123.4,92.05 IC7.18
FLASHER2
  Top 1: IC7.15 IC7.16 119.49,83.1 118.1,83.1 116.9,84.3 116.9,88.9 121.9,93.9 121.9,101.3 123.7,103.1 126.5,103.1 127.75,101.85 J1.13
FLASHER3
  Top 1: IC7.13 IC7.14 117.4,78 115.5,79.9 115.5,89.7 120.4,94.6 120.4,101.9 123,104.5 128.3,104.5 130.29,102.51 J1.11
FLASHER4
  Top 1: IC7.11 IC7.12 117.68,72.92 114.1,76.5 114.1,90.7 118.9,95.5 118.9,102.5 122.3,105.9 130.2,105.9 132.83,103.27 J1.9
FLASHER5
  Top 1: IC8.17 IC8.18 | IC8.18 132.56,88.06 | IC8.18 135.55,91.1 145.7,91.1 149.4,94.8 149.4,103.1 146.5,106 137.6,106 135.37,103.77 J1.7
FLASHER6
  Top 1: IC8.15 IC8.16 130.82,82.98 130,83.8 130,89.2 133.2,92.4 144.9,92.4 148.1,95.6 148.1,102.4 145.9,104.6 139.6,104.6 137.91,102.91 J1.5
FLASHER7
  Top 1: IC8.13 IC8.14 130.1,77.9 128.6,79.4 128.6,90.2 132.1,93.7 144,93.7 146.6,96.3 146.6,101.7 145.2,103.1 141.3,103.1 140.45,102.25 J1.3
FLASHER8
  Top 1: IC8.11 132.51,72.3 | 132.51,72.3 IC8.12 | 132.51,72.3 129.9,72.3 127.2,75 127.2,91.4 130.8,95 143.1,95 145.2,97.1 145.2,100.3 144.33,101.17 J1.1
FLASHER9
  Bottom 1: IC10.11 IC10.12 | IC10.11 144.88,70.28 | IC10.11 143.38,70.28 141.5,68.4 141.5,67.2 140.1,65.8 130.2,65.8 129,67 129,91.3 125.21,95.09 J1.16
FLASHER10
  Bottom 1: IC10.13 IC10.14 143.1,77.9 140.9,80.1 140.9,88.6 140,89.5 135.3,89.5 127.75,97.05 J1.14
FLASHER11
  Bottom 1: IC10.15 IC10.16 143.12,82.98 142.2,83.9 142.2,89.6 141,90.8 136.3,90.8 130.29,96.81 J1.12
FLASHER12
  Bottom 1: IC10.17 IC10.18 144.81,90.89 143.3,92.4 137.2,92.32 132.83,96.69 J1.10
FLASHER13
  Bottom 1: IC9.13 IC9.14 155.6,77.8 152.8,80.6 152.8,88.2 147.2,93.8 138.4,93.8 135.37,96.83 J1.8
FLASHER14
  Bottom 1: IC9.15 IC9.16 155.62,82.88 154.4,84.1 154.4,88.8 147.9,95.3 139.7,95.3 137.91,97.09 J1.6
FLASHER15
  Bottom 1: IC9.17 IC9.18 157.01,88.49 148.7,96.8 141.4,96.8 140.45,97.75 J1.4
FLASHER16
  Bottom 1: IC9.12 IC9.11 155.88,70.18 154.7,69 154.7,58.9 J13.1
GND  (via drill 0.35, 0.5, 0.55)
  Top 1: IC7.9 110.26,67.84 | IC8.9 126.46,67.74 | IC9.9 147.74,67.64 | IC10.9 135.64,67.74
  Top 1.5: J2.1 96.3,105 | J2.2 100.26,100.84 | J2.3 104.22,100.72 | J2.4 108.2,100.6
  Bottom 1: IC7.9 110.26,67.84 | IC8.9 126.36,67.74 | IC10.9 135.56,67.74 | IC9.9 147.64,67.64
  Bottom 1.5: J2.1 96.3,100.7 | J2.2 100.26,100.64 | J2.3 104.22,100.68 | J2.4 108.18,100.62 | J13.2 155.7,51.7
  other vias: 34.3,84.7 41,84.7 47.8,84.7 61.1,84.8 74.8,84.7 112.8,20.9 88.8,84.8 68.1,84.8 81.8,84.8 134.9,71.6 95.6,34.4 106.3,48.8 78.7,51.5 88.3,53.4 98.6,49.4 75.6,57.9 82,35 83.2,45.1 111.6,5.1 138.3,13.3 138.4,16.8 138.4,19.7 138.3,22.8 81.9,20.4 76.4,19.4 78.5,19.5 75.7,3.2 108.4,4.1 29.8,10.7 26,10.7 23.4,10.7 21,10.7 18.3,10.7 15.7,10.7 33.4,10.7 45.1,30.3 54.6,19.8 22.4,56.1 22.5,53.5 22.5,51 22.4,47.2 89.2,22.8 89.5,18.1 89.7,11.2 140,30.5 140,34 141.2,39.3 140.6,36.1
  pour Top: 0.2,106.8 160.1,106.8 160.1,-0.2 0.2,-0.2
  pour Bottom: 0.2,106.8 160,106.7 160,0.2 0.2,0.2
IR_IN  (via drill 0.6)
  Top 0.5: J10.3 95.36,20.36 v95.4,20.4
  Bottom 0.5: v95.4,20.4 94.9,20.9 85.18,20.9 PICO1.GP4
IR_LED_CATHODE
  Top 1: Q13.1 108.3,16.9 104.43,13.03 J11.2
IR_OUT
  Top 0.5: PICO1.GP0 88.44,8.44 93.49,13.49 R19.1
LED_B
  Top 0.5: R10.1 103.2,56.8 104.4,55.6 104.4,54.2 102.8,52.6 102.8,47.5 101.7,46.4 93.6,46.4 91.3,44.1 91.3,18.4 88.96,16.06 PICO1.GP2
LED_G
  Top 0.5: R11.1 103.6,59 105.3,57.3 105.3,53.8 103.7,52.2 103.7,47 102.2,45.5 94,45.5 92.3,43.8 92.3,15.2 88.08,10.98 PICO1.GP1
LED_R
  Top 0.5: R9.1 101.9,53.81 101.9,48.1 101.2,47.4 93.2,47.4 90.4,44.6 90.4,20.2 88.8,18.6 PICO1.GP3
N$1
  Top 1: R1.1 31.4,80.1 IC1.7
N$2
  Top 1: R2.1 39.9,81.8 38.5,80.4 IC1.5
N$3
  Top 1: R1.2 34.2,80.1 31.24,83.06 Q1.1
N$4
  Top 1: R2.2 37.94,84.78 Q2.1
N$5
  Top 1: R3.1 44.6,80.1 IC2.7
N$6
  Top 1: IC2.5 51.71,80.27 R4.1
N$7
  Top 1: R3.2 47.2,80.1 44.54,82.66 Q3.1
N$8
  Top 1: R4.2 51.34,84.98 Q4.1
N$9
  Top 1: R5.1 57.9,80.1 IC3.7
N$10
  Top 1: IC3.5 64.91,80.27 R6.1
N$11
  Top 1: R5.2 60.2,80.1 58.14,82.16 Q5.1
N$12
  Top 1: Q6.1 64.94,85.28 R6.2
N$13
  Top 1: R7.1 71.1,80.2 IC4.7
N$14
  Top 1: IC4.5 78.11,80.37 R8.1
N$15
  Top 1: Q7.1 71.94,82.26 73.9,80.2 R7.2
N$16
  Top 1: R8.2 74.98,82 Q8.1
N$17
  Top 1: PICO2.VSYS 122.51,10.71 121.6,9.8 D1.1
N$18
  Bottom 0.5: R9.2 110.6,54.6 111.1,54.1 117.6,54.1 118.77,55.27 LED2.1
N$19
  Top 1: R14.1 84.3,80.2 IC5.7
N$20
  Top 1: IC5.5 91.31,80.27 R15.1
N$21
  Bottom 0.5: IC11.10 22.75,26.75 21.8,27.7 21.8,43.2 23.21,44.61 IC12.9
N$22
  Top 0.5: IC12.10 24.55,47.15 25.3,47.9 25.3,58.1 24.8,58.6 23.4,58.6 22.5,59.5 22.5,63.9 23.51,64.91 IC16.9
N$23
  Bottom 0.5: IC16.10 22.95,67.45 21.6,68.8 21.6,84 22.81,85.21 IC18.9
N$24
  Top 0.5: Q15.3 99.64,57.24 96.7,54.3 R26.2
N$25
  Top 1: Q9.1 85.54,81.56 86.9,80.2 R14.2
N$26
  Top 1: R15.2 88.98,82 Q10.1
N$27
  Top 1: R16.1 97.5,80.2 IC6.7
N$28
  Top 1: IC6.5 104.51,80.27 R17.1
N$29
  Top 1: R16.2 100.4,80.2 99.24,81.46 Q11.1
N$30
  Top 1: R17.2 102.18,82 Q12.1
N$31
  Bottom 0.4: R33.2 103.7,49.5 106.4,46.8 109.7,46.8 110.94,48.04 Q16.2
N$32
  Top 0.5: D4.A 113.5,19.1 115.5,16.7 D3.C
N$33
  Bottom 1: Q13.3 103.1,18.6 105,16.7 108.4,16.7 110.9,14.2 R31.2
N$34  (via drill 0.45)
  Top 0.4: v121.5,24.3 121.5,28.5 118.9,31.1 118.9,33 117.8,34.1 117.8,36.8 114.9,39.7 114.9,44.11 R32.2
  Bottom 0.4: PICO2.3V3 123.07,18.33 122.1,19.3 122.1,23.7 v121.5,24.3
N$35
  Top 0.5: S2.3 116.74,47.9 | 116.74,47.9 S2.4 116.74,43.06 119,40.8 119,34.4 119.3,34.1 119.3,34.07 119.8,33.57 PICO2.RUN | Q16.3 115.94,48.7 116.74,47.9
  Bottom 0.5: R32.1 109.28,44.5 Q16.3
N$36
  Top 0.4: R34.1 61.32,31.71 S1.3 63.45,33.84 PICO1.RUN
  Bottom 0.4: S1.4 S1.3
N$37
  Top 0.5: R10.2 109.2,56.8 108.2,55.8 108.2,53.9 109.4,52.7 112.5,52.7 114.71,54.91 LED2.3
N$38
  Top 0.5: R12.1 28.6,30.55 R13.2 38.39,32.29 40.09,34.09 JP3.2
N$45
  Top 0.5: R11.2 111.23,59 112.42,57.81 LED2.4
N$58
  Bottom 0.4: IC13.3 104.29,32.8 108.5,32.8 112.33,28.97 IC14.7 114.8,28.97 117.3,31.47 R20.1
N$59
  Top 0.4: IC14.2 104.57,28.97 102.7,27.1 102.7,25.69 R18.2 102.21,25.51
N$63
  Top 0.5: IC15.1 97.17,33.41 IC13.1
N$65
  Top 0.4: R21.2 105.2,23.3 IC14.4
N$68
  Top 0.4: IC14.3 106.43,26.43 108.14,28.14 IC13.5
OUT1
  Top 2.5: Q1.2 33.6,88.3 34.5,89.2 34.5,101.74 J4.1
OUT2
  Top 2.5: Q2.2 40,88.4 41.2,89.6 41.2,96.4 43.68,98.88 J4.3
OUT3
  Top 2.5: Q3.2 46.9,88.3 47.9,89.3 47.9,100.35 J4.4
OUT4
  Top 2.5: Q4.2 53.6,88.3 54.8,89.5 54.8,92.4 53.4,93.8 52.6,93.8 51.61,94.79 J4.5
OUT5
  Top 2.5: Q5.2 60,88.3 61.5,89.8 61.5,92.6 60.3,93.8 57.8,93.8 55.57,96.03 J4.6
OUT6
  Top 2.5: Q6.2 67.1,88.3 68.4,89.6 68.4,92.8 67.1,94.1 64.3,94.1 59.53,98.87 J4.7
OUT7
  Top 2.5: Q7.2 74.2,88.3 75.2,89.3 75.2,92.2 73.8,93.6 71.9,93.6 68.4,97.1 67.1,97.1 63.49,100.71 J4.8
OUT8
  Top 2.5: Q8.2 81,88.3 82,89.3 82,92.6 80.7,94 77.5,94 74.9,96.6 73.1,96.6 67.46,102.24 J4.9
OUT9
  Top 2.5: Q9.2 88,88.3 88.9,89.2 88.9,92.1 87.5,93.5 85.2,93.5 81.6,97.1 79.1,97.1 75.58,100.62 J3.1
OUT10
  Top 2.5: Q10.2 95,88.3 95.9,89.2 95.9,92.3 94.7,93.5 91.4,93.5 88.4,96.5 86.6,96.5 83.5,99.6 J3.3
OUT11
  Top 2.5: Q11.2 101.8,88.3 102.4,88.9 102.4,89 102.7,89.3 102.7,92.4 101.4,93.7 98.6,93.7 95.9,96.4 92.6,96.4 87.47,101.53 J3.4
OUT12
  Top 2.5: Q12.2 108,88.3 109.3,89.6 109.3,93.6 106.3,96.6 99.9,96.6 97.2,99.3 93.8,99.3 91.43,101.67 J3.5
OUTCTL1  (via drill 0.55)
  Top 0.5: v72.5,35.6 72.5,56.8 70.4,58.9 39.2,58.9 35.15,62.95 34.4,63.7 33.43,64.67 IC1.2
  Bottom 0.5: PICO1.GP8 74.26,33.84 v72.5,35.6
OUTCTL2  (via drill 0.55)
  Top 0.5: v73.4,37.8 73.4,57.3 71,59.7 44.7,59.7 40.2,64.2 39.8,64.6 38.51,65.89 IC1.4
  Bottom 0.5: PICO1.GP9 74.82,36.38 v73.4,37.8
OUTCTL3  (via drill 0.55)
  Top 0.5: v77.7,60.6 53.2,60.6 46.63,67.17 IC2.2
  Bottom 0.5: PICO1.GP14 84.14,54.16 v77.7,60.6
OUTCTL4  (via drill 0.55)
  Top 0.5: v81.3,60.8 80.6,61.5 58.4,61.5 51.71,68.19 IC2.4
  Bottom 0.5: PICO1.GP15 84.94,57.16 v81.3,60.8
OUTCTL5
  Top 0.5: 59.83,69.67 IC3.2 59.83,69.27 63.1,66 94.7,66 100.2,60.5 118.8,60.5 122.87,56.43 PICO2.GP16
OUTCTL6
  Top 0.5: IC3.4 64.91,68.99 67,66.9 95.1,66.9 100.5,61.5 119.3,61.5 122.3,58.5 126.3,58.5 127.7,57.1 127.7,55.2 126.39,53.89 PICO2.GP17
OUTCTL7
  Top 0.5: IC4.2 73.03,69.37 74.7,67.7 95.8,67.7 101,62.5 119.9,62.5 123,59.4 126.8,59.4 128.7,57.5 128.7,50.2 127.31,48.81 PICO2.GP18
OUTCTL8
  Top 0.5: IC4.4 78.11,69.69 79.3,68.5 96.4,68.5 101.4,63.5 120.4,63.5 123.5,60.4 127.3,60.4 129.7,58 129.7,49.4 126.57,46.27 PICO2.GP19
OUTCTL9
  Bottom 0.5: IC5.2 86.23,68.67 90.6,64.3 90.6,40.9 92.7,38.8 115.6,38.8 116.6,37.8 121.7,37.8 123.39,36.11 PICO2.GP22
OUTCTL10
  Bottom 0.5: IC5.4 91.5,69.94 91.5,41.3 92.9,39.9 114.1,39.9 115.3,41.1 125.62,41.1 PICO2.GP21
OUTCTL11
  Top 0.5: PICO2.GP20 126.63,43.73 130.7,47.8 130.7,58.5 127.8,61.4 124.1,61.4 121,64.5 102.1,64.5 99.43,67.17 IC6.2
OUTCTL12
  Top 0.5: PICO2.GP28_A2 126.71,23.41 131.6,28.3 131.6,59 128.3,62.3 124.7,62.3 121.6,65.4 105.8,65.4 104.51,66.69 IC6.4
PLUNGER_ADC  (via drill 0.6)
  Top 0.4: 58.31,22.78 58.08,22.78
  Top 0.5: JP3.5 47.71,30.29 55.22,22.78 55.38,22.78 | PICO1.GP28_A2 63.18,23.68 62.28,22.78 58.31,22.78 55.38,22.78 | 55.38,22.78 v54.7,22.1
  Bottom 0.5: J9.8 49.72,17.12 v54.7,22.1
PLUNGER_IRQ1_SCL
  Top 0.4: PICO1.GP13 82.28,49.08 75.1,41.9 75.1,12 66.1,3 55.8,3 53.4,5.4 53.4,11.1 51.1,13.4 48.1,13.4 47.18,12.48 J9.6
PLUNGER_IRQ2
  Bottom 0.5: PICO1.GP27_A1 62.66,28.76 57.1,23.2 57.1,19.1 52,14 52,8.2 50.3,6.5 48.2,6.5 47.2,7.5 47.2,8.6 47.18,8.62 J9.5
PLUNGER_SDA
  Top 0.4: PICO1.GP12 82.24,46.54 77.5,41.8 77.5,10.1 68.6,1.2 49.3,1.2 42.1,8.4 J9.1
PSU2_STATUS_SENSE  (via drill 0.55)
  Top 0.5: R22.2 116.3,30.8 116.3,35.4 v116.5,35.6
  Bottom 0.5: R22.2 117.6,26.3 115.19,23.89 IC14.5 | v116.5,35.6 116.5,36.2 114.9,37.8 92.2,37.8 89.6,40.4 89.6,42 87.6,44 PICO1.GP11
PSU2_STATUS_SET  (via drill 0.55)
  Top 0.5: v103,36.8 103,36.7 104.4,35.3 104.4,32.9 IC14.1
  Bottom 0.5: PICO1.GP10 87.74,41.46 88.5,40.7 88.5,40.2 91.9,36.8 | 91.9,36.8 92.3,36.4 | 91.9,36.8 v103,36.8
SCL  (via drill 0.45)
  Top 0.4: JP2.4 45.27,39.67 43.9,38.3 43.9,27.7 42.7,26.5 42.7,23.17 JP4.3 42.63,21.37 45,19 v62.7,19 61.8,19.9 R30.1 | v62.4,12.5 61.6,11.7 QWIIC1.4 61.6,8.6 v62.5,7.7 | PICO1.GP7 84.6,31.3 81.1,27.8 81.1,7.4 v84.4,4.1 85.3,3.2 109.7,3.2 110.9,2 v123.7,2 144.6,2 149.5,6.9 149.5,21.4 153.3,25.2 153.3,30.6 151.62,32.28 J14.3
  Bottom 0.4: v62.7,19 63,18.7 63,13.1 v62.4,12.5 | PICO2.GP27_A1 126.91,28.49 128.4,27 128.4,6.7 v123.7,2 | v84.4,4.1 66.1,4.1 v62.5,7.7
SDA  (via drill 0.45, 0.5)
  Top 0.4: JP2.5 47.81,39.91 46.45,38.55 46.45,26.55 45.17,25.27 JP4.4 45.17,21.53 46,20.7 58.9,20.7 59.1,20.5 | v60.5,10.6 60.6,10.5 QWIIC1.3 60.5,8.91 v60.5,7.7 | PICO1.GP6 84.66,28.76 82.7,26.8 82.7,7 84.4,5.3 88.6,5.3 | J14.5 147.5,34.76 147.5,7.8 143.9,4.2 v128.4,4.2 116.6,4.2 113.6,7.2 103.9,7.2 102,5.3 88.6,5.3 | 88.6,5.3 v87.3,4 | 59.1,20.5 v59.7,19.9 | R29.1 59.1,20.5
  Bottom 0.4: JP4.4 45.17,21.77 | v59.7,19.9 60.5,19.1 v60.5,10.6 | PICO1.GP6 87.34,28.76 94.1,22 115,22 119.2,26.2 119.2,29 121.23,31.03 PICO2.GP26_A0 126.87,31.03 129.8,28.1 129.8,5.6 v128.4,4.2 | v87.3,4 85.7,2.4 62.5,2.4 60.5,4.4 v60.5,7.7
UART0_RX
  Top 0.406: J12.3 61.86,50.96 65.06,54.16 PICO1.GP17
UART0_TX
  Top 0.4: 61.66,56.6 J12.1
  Top 0.406: PICO1.GP16 62.56,56.7 61.66,56.6
VBUS
  Top 1: D1.2 108.7,5.7 111.2,3.2 144.4,3.2 148.5,7.3 148.5,25.6 J14.1
  Bottom 1: PICO1.VBUS 69.46,8.44 72.8,5.1 106.9,5.1 D1.2

## Text on the board
tPlace: UART | TX | GND | RX | LIS3DH / Module | RESET | RESET | ADS1115 / Module
tNames: FLASHERS | 1 | X | 2 | 3 | 4 | 5 | 6 | 7 | 8 | 9 | X | 10 | 11 | 12 | GND | GND | GND | GND | 12V | 5V | HIGH POWER OUTPUTS 1-8 | HI PWR 9-12 | 2ND PSU | BUTTONS 25-32 | PINSCAPE PICO | DIY MAIN BOARD REV 20250203 | + | MAIN PICO | PWMWORKER 0 | GND/STROBE | + | BUTTONS 17-24 | TO POWER BOARD | BUTTONS 9-16 | PLUNGER | IR-RX | IR-TX | BUTTONS 1-8 | QWIIC